# EAGLE design Adafruit MIDI FeatherWing (EAGLE 9.6.2)
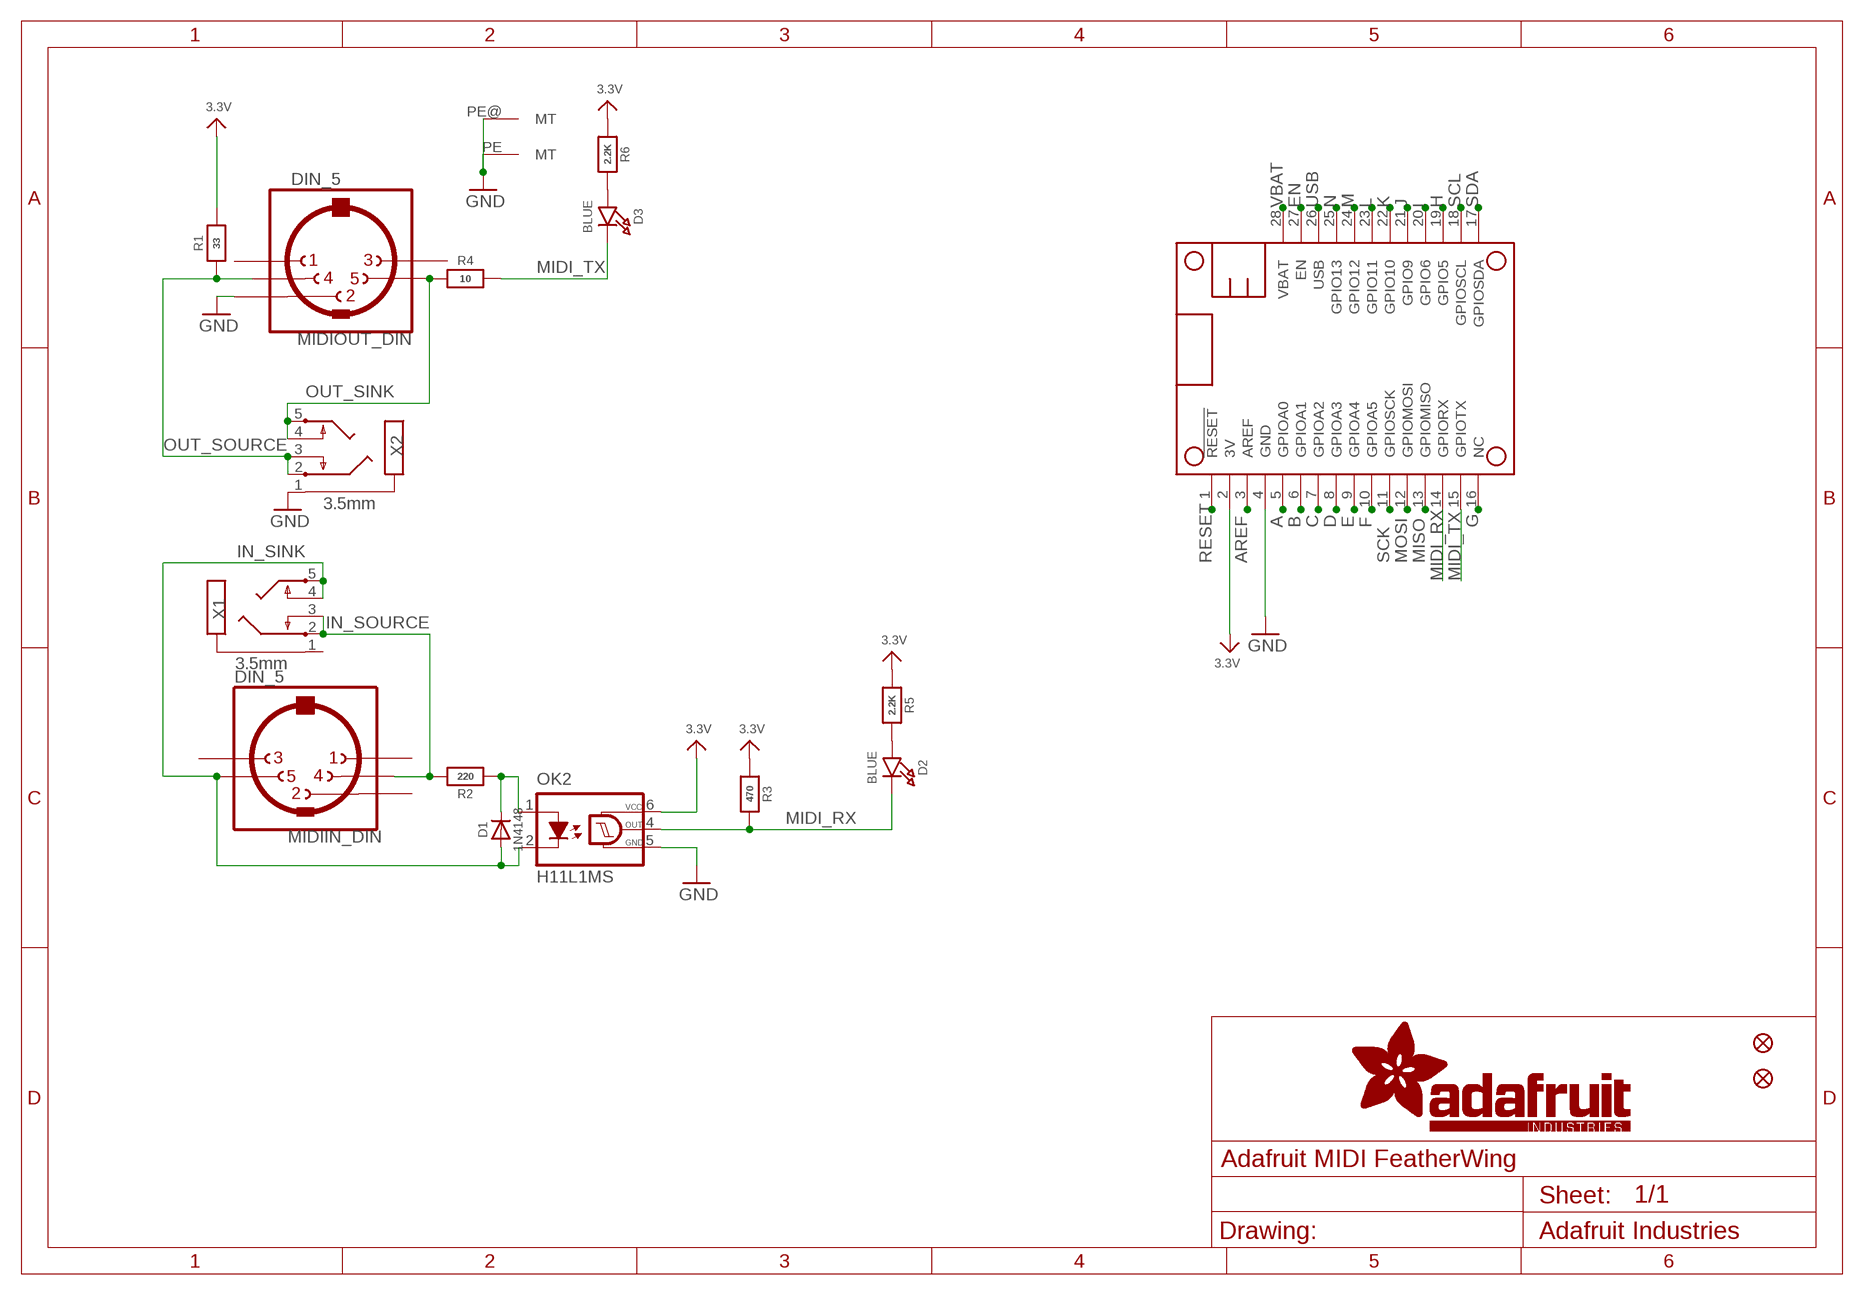
[diagram p0: schematic, sheet 1]

## Parts
D1  1N4148  DIODESOD-323  [SOD-323]
D2  BLUE  LED0603  [CHIPLED_0603]
D3  BLUE  LED0603  [CHIPLED_0603]
FID1  FIDUCIAL_1MM  [FIDUCIAL_1MM]
FID2  FIDUCIAL_1MM  [FIDUCIAL_1MM]
MIDIIN  DIN_5  [CP-2350]
MIDIOUT  DIN_5  [CP-2350]
MS1  FEATHERWING_NODIM  [FEATHERWING_NODIM]
OK2  H11L1MS  [DIL6-SMD]
R1  33  RESISTOR_0603_NOOUT  [0603-NO]
R2  220  RESISTOR_0603_NOOUT  [0603-NO]
R3  470  RESISTOR_0603_NOOUT  [0603-NO]
R4  10  RESISTOR_0603_NOOUT  [0603-NO]
R5  2.2K  RESISTOR_0603_NOOUT  [0603-NO]
R6  2.2K  RESISTOR_0603_NOOUT  [0603-NO]
X1  3.5mm  AUDIO_STEREOJACK  [STX3100]
X2  3.5mm  AUDIO_STEREOJACK  [STX3100]

## Nets
3.3V: MS1.2(3V) OK2.6(VCC) R1.2 R3.1 R5.1 R6.1
A: MS1.5(GPIOA0)
AREF: MS1.3(AREF)
B: MS1.6(GPIOA1)
C: MS1.7(GPIOA2)
D: MS1.8(GPIOA3)
E: MS1.9(GPIOA4)
EN: MS1.27(EN)
F: MS1.10(GPIOA5)
G: MS1.16(NC)
GND: MIDIOUT.2 MIDIOUT.PE(MT) MIDIOUT.PE@(MT) MS1.4(GND) OK2.5(GND) X2.1
H: MS1.19(GPIO5)
I: MS1.20(GPIO6)
IN_SINK: D1.A MIDIIN.5 OK2.2(C) X1.4 X1.5
IN_SOURCE: MIDIIN.4 R2.2 X1.2 X1.3
J: MS1.21(GPIO9)
K: MS1.22(GPIO10)
L: MS1.23(GPIO11)
M: MS1.24(GPIO12)
MIDI_RX: D2.C MS1.14(GPIORX) OK2.4(OUT) R3.2
MIDI_TX: D3.C MS1.15(GPIOTX) R4.2
MISO: MS1.13(GPIOMISO)
MOSI: MS1.12(GPIOMOSI)
N: MS1.25(GPIO13)
N$1: D2.A R5.2
N$2: D3.A R6.2
N$33: D1.C OK2.1(A) R2.1
OUT_SINK: MIDIOUT.5 R4.1 X2.4 X2.5
OUT_SOURCE: MIDIOUT.4 R1.1 X2.2 X2.3
RESET: MS1.1(!RESET)
SCK: MS1.11(GPIOSCK)
SCL: MS1.18(GPIOSCL)
SDA: MS1.17(GPIOSDA)
USB: MS1.26(USB)
VBAT: MS1.28(VBAT)
Unconnected: MIDIIN.1 MIDIIN.2 MIDIIN.3 MIDIIN.PE1(MT) MIDIIN.PE2(MT) MIDIIN.PE(MT) MIDIIN.PE@(MT) MIDIOUT.1 MIDIOUT.3 MIDIOUT.PE1(MT) MIDIOUT.PE2(MT) X1.1

## Library data of the parts
D1 = microbuilder:DIODE: Diode SMA Model Volts Amps Type Vf Ir Digikey # Notes SSA34-E3 40V 3A Schottky 480mV @ 3A 200uA @ 40V SSA34-E3/61TGITR-ND CDBA120-G 20V 1A Schottky 500mV @ 1A 500uA @ 20V 641-1014-6-ND REEL MBRA210 10V 2A Schottky 350mV @ 2A 700uA @ 10V MBRA210LT3 SOD-123 Model Volts Amps Type Vf Ir Order # Notes BAT54T1G 30V 200mA Schottky 800mV @ 200mA 2uA @ 25V BAT54T1GOSTR-ND B0530W 30V 500mA Schottky 430mV @ 500mA 130uA @ 30V B0530W-FDICT-ND REEL MBR120 20V 1A Schottky 340mV @ 1A MBR120VLSFT1GOSCT-ND SOD-323 Model Volts Amps Type Vf Ir Order # Notes PMEG2005EJ 20V 500mA Schottky 355mV @ 500mA 568-4110-1-ND ZLLS410 10V 570mA Schottky 380mV @ 570mA ZLLS410CT-ND 1N4148WS 75V 150mA Silicon/Simple 1V 1N4148WSFSCT-ND REEL SOD-523 Model Volts Amps Type Vf Ir Order # Notes BAT54XV2 30V 200mA Schottky 0.8V @ 100mA BAT54XV2CT-ND TB751S 30V 30mA Schottky RB751S-40TE61CT-ND SOT23-R/W (R = Solder Paste/Reflow Ovens, W = Hand-Soldering) Model Volts Amps Type Vf Ir Order # Notes BAT54FILM 40V 300mA Schottky 497-7162-1-ND POWERDI-5 Model Volts Amps Type Vf Ir Order # Notes PDS560 60V 5A Schottky 670mV @ 5A 150uA @ 60V PDS560DICT-ND
D2 D3 = microbuilder:LED: LED 0603 - 0603 Surface Mount Package 2mA: Green LED - Low Power (3.9mcd, 2ma, 1.7Vf) - Digikey: 475-2709-2-ND Orange LED - Low Power (9.8mcd, 2ma, 1.8Vf) - Digikey: 475-1194-2-ND Red LED - Low Power (5mcd, 2ma, 1.8Vf) - Digikey: 475-1195-2-ND Yellow LED - Low Power (7mcd, 2ma, 1.8Vf) - Digikey: 475-1196-2-ND 5mA: Blue LED - Low Power (17mcd, 5ma, 2.9Vf) - Digikey: LNJ937W8CRACT-ND 0805 - 0805 Surface Mount Package 2mA: Red LED (8.8mcd, 2mA, 1.8Vf, Clear) - Low Power [Digikey: 475-2510-1-ND] Green LED (5mcd, 2mA, 1.8Vf, Clear) - Low Power [Digikey: 475-2730-1-ND] Yellow LED (11.3mcd, 2mA, 1.8Vf, Clear) - Low Power [Digikey: 475-2555-1-ND] 20mA: Red LED (104mcd, 20mA, Diffused) - LS R976 [Digikey: 475-1278-6-ND] Red LED (12mcd, 20mA, 2.0Vf, Clear) - APT2012EC [Digikey: 754-1128-1-ND] Green LED (15mcd, 20mA, 2.2Vf, Clear) - APT2012GC [Digikey: 754-1131-1-ND] Orange LED (160mcd, 20mA, 2.1Vf, Clear) - APT2012SECK [Digikey: 754-1130-1-ND] 1206 - 1206 Surface Mount Package Green LED (26mcd, 20mA, Diffused) - LG N971 [Digikey: 475-1407-6-ND] Red LED (15mcd, 20mA, Diffused) - LH N974 [Digikey: 475-1416-6-ND] Cree - Cree High-Power Surface Mount LEDs XPEBWT-L1-0000-00D50 - White 111lm 350mA 2.9Vf 6200K 110° XTEAWT-00-0000-00000LEE3 - White 114lm 350mA 2.85Vf 5000K 115° Everlight - Everlight 45-21 Series Surface Mount LEDs 45-21/QK2C-B2832AC2CB2/2T - Warm White 2000mcd 20mA 3.25Vf 3050K 120° 45-21/LK2C-B38452C4CB2/2T - Nuetral White 2000mcd 20mA 3.25Vf 4150K 120° 45-21/LK2C-B50634C6CB2/2T - Cold White 2200mcd 20mA 3.25Vf 5650K 120° PLCC2 Reverse Mount LS T77K-J1L2-1-0-2-R18-Z - Red 11.25mcd 2mA 1.8Vf 630nm 120° LO T77K-L1M2-24-Z - Orange 19.6mcd 2mA 1.8Vf 606nm 120° LY T77K-K2M1-26-Z - Yellow 15.7mcd 2mA 1.8Vf 587nm 120°
FID1 FID2 = microbuilder:FIDUCIAL: Fiducial Alignment Points Various fiducial points for machine vision alignment.; BOM: EXCLUDE
MIDIIN MIDIOUT = microbuilder:DIN_5
MS1 = microbuilder:FEATHERWING
OK2 = optocoupler:H11L*M: 6-Pin DIP Optocoupler Source: http://www.fairchildsemi.com/ds/H1/H11L2-M.pdf; OC_FARNELL: unknown; OC_NEWARK: unknown
R1-R6 = microbuilder:RESISTOR: Resistors For new designs, use the packages preceded by an '_' character since they are more reliable: The following footprints should be used on most boards: _0402 - Standard footprint for regular board layouts _0603 - Standard footprint for regular board layouts _0805 - Standard footprint for regular board layouts _1206 - Standard footprint for regular board layouts For extremely tight-pitch boards where space is at a premium, the following 'micro-pitch' footprints can be used (smaller pads, no silkscreen outline, etc.): _0402MP - Micro-pitch footprint for very dense/compact boards _0603MP - Micro-pitch footprint for very dense/compact boards _0805MP - Micro-pitch footprint for very dense/compact boards _1206MP - Micro-pitch footprint for very dense/compact boards
X1 X2 = microbuilder:AUDIO_STEREOJACK: MIC/HEADPHONE JACK Stereo jack with two switches. Kycon STX3100, CUI SJ1-3555NG and/or 4UCon 05544 Digikey: CP1-3555NG-ND Shamelessly taken from the Adafruit Eagle library (public domain) ... thanks! These are normally connected as follows, from right-to-left on the schematic symbol above: Tip: Left Audio Inner Ring: Right Audio Shell: Common/GND

## Net classes
1 VCC: width 0.305 mm
2 GND: width 0.813 mm
3 HV: width 0.381 mm

## Board
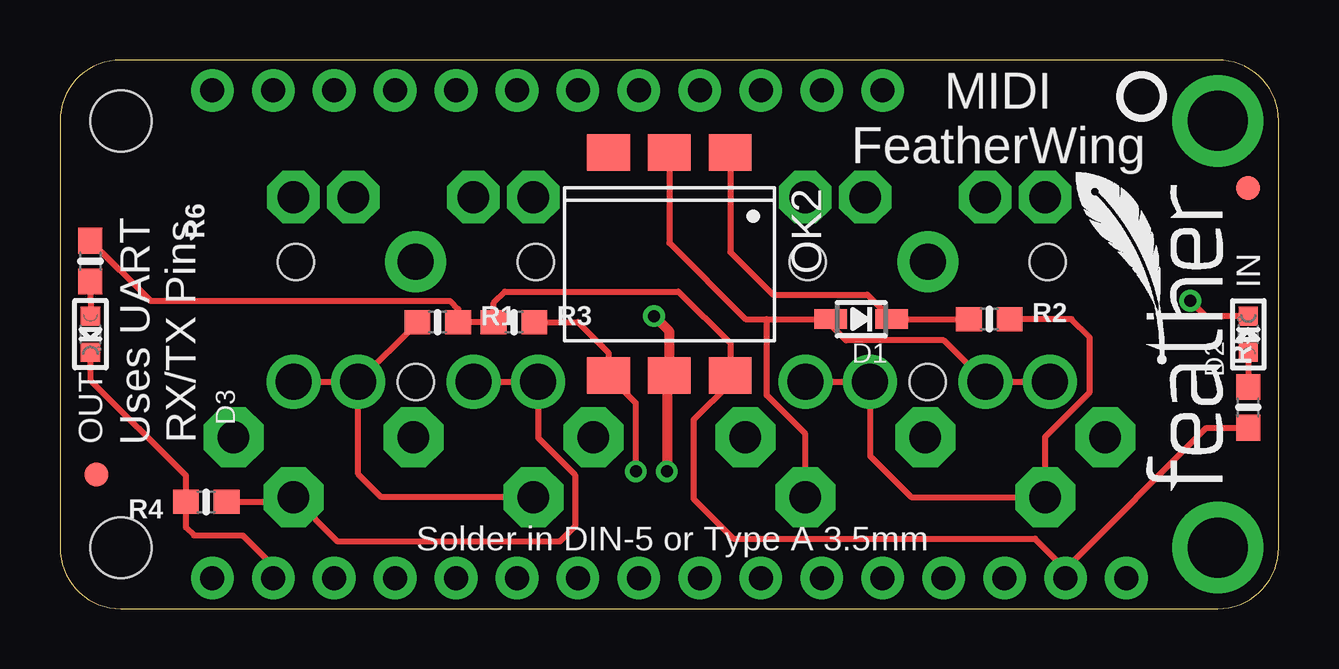
[diagram p1: board, top side]
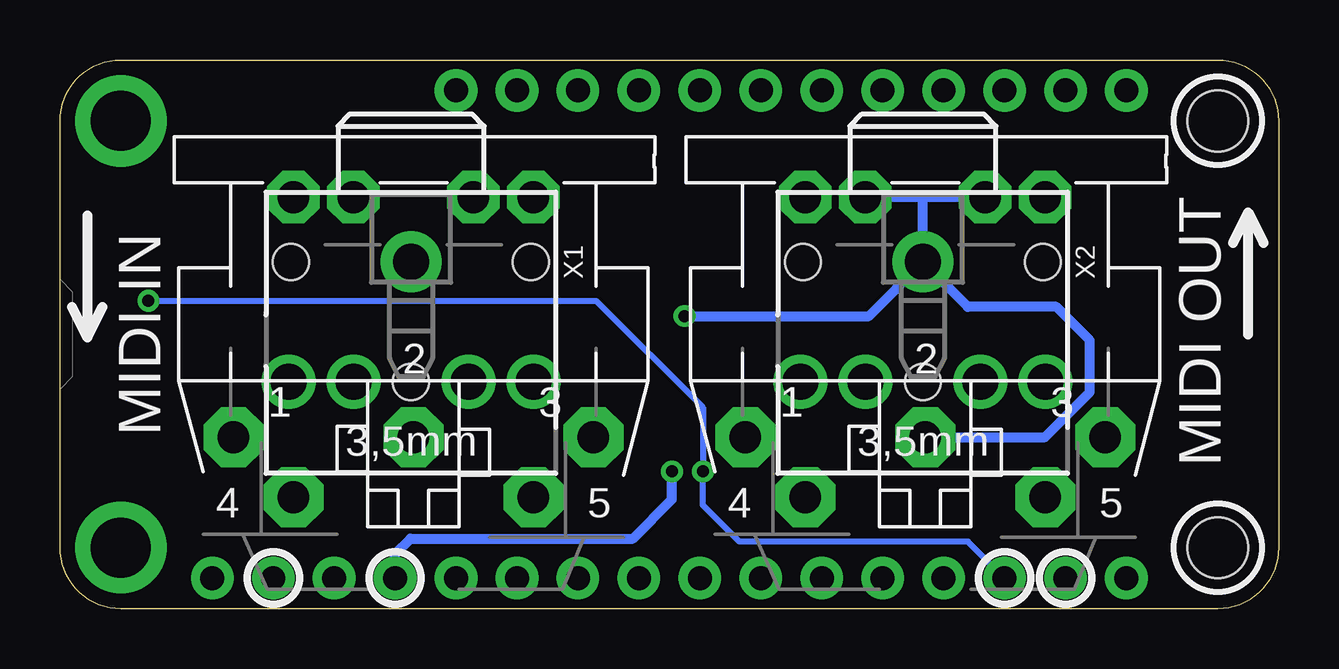
[diagram p2: board, bottom side, seen from below]

Size 50.8 x 22.86 mm. Coordinates in mm from the lower left corner, seen from the top.
Outline: 0,20.32 0,2.54 arc90 2.54,0 48.26,0 arc90 50.8,2.54 50.8,20.32 arc90 48.26,22.86 2.54,22.86 arc90 0,20.32
Copper layers (1*16): Top 0.035mm / dielectric 1.5mm / Bottom 0.035mm
Design rules "adafruit": minimum track width 8mil, minimum drill 15.5mil, track to track 8mil, track to pad 8mil, pad to pad 8mil, via to via 8mil, smd to smd 8mil, copper to edge 10mil, drill to drill 8mil, minimum pad ring 10mil, minimum via ring 8mil, stop-mask expansion 2mil, vias tented up to drill 20mil, thermal gap 10mil

### Footprints (pad centres in the part's own frame; a part is rotated, then mirrored left to right if it is on the bottom)
SOD-323 = smd 1.35 x 0.8: A 1.27,0; C -1.27,0
CHIPLED_0603 = smd 0.8 x 0.8: A 0,-0.75; C 0,0.75
FIDUCIAL_1MM = smd 1 x 1: 1 0,0
CP-2350 = drill 1.321 pad 2.5 octagon: 1 7.5,10; 2 0,10; 3 -7.5,10; 4 5,12.5; 5 -5,12.5 | drill 1.321 pad 2.184 octagon: PE -2.5,0; PE1 -5,0; PE2 5,0; PE@ 2.5,0
FEATHERWING_NODIM = drill 1 pad 1.778: 1 6.35,1.27; 2 8.89,1.27; 3 11.43,1.27; 4 13.97,1.27; 5 16.51,1.27; 6 19.05,1.27; 7 21.59,1.27; 8 24.13,1.27; 9 26.67,1.27; 10 29.21,1.27; 11 31.75,1.27; 12 34.29,1.27; 13 36.83,1.27; 14 39.37,1.27; 15 41.91,1.27; 16 44.45,1.27; 17 44.45,21.59; 18 41.91,21.59; 19 39.37,21.59; 20 36.83,21.59; 21 34.29,21.59; 22 31.75,21.59; 23 29.21,21.59; 24 26.67,21.59; 25 24.13,21.59; 26 21.59,21.59; 27 19.05,21.59; 28 16.51,21.59 | drill 2.5 pad 3.81: P$1 2.54,20.32; P$2 2.54,2.54 | hole 2.54: 48.26,20.32; 48.26,2.54
DIL6-SMD = smd 1.78 x 1.52: 1 -2.54,-4.645; 2 0,-4.645; 3 2.54,-4.645; 4 2.54,4.645; 5 0,4.645; 6 -2.54,4.645
0603-NO = smd 1.075 x 1: 1 -0.85,0; 2 0.85,0
STX3100 = drill 1.5 pad 2.54: 1 2.7,-0.1 | drill 1.5: 2 7.7,5; 3 7.7,2.3; 4 7.7,-2.5; 5 7.7,-5.2 | hole 1.5: 2.7,4.9; 2.7,-5.1; 7.7,-0.1

### Placement (x,y rotation side)
D1  33.4,12.06 180 top
D2  49.53,11.43 0 top
D3  1.27,11.43 180 top
FID1  1.52,5.59 0 top
FID2  49.53,17.53 0 top
MIDIIN  36.07,17.14 180 bottom
MIDIOUT  14.73,17.14 180 bottom
MS1  50.8,0 0 bottom
OK2  25.4,14.35 180 top
R1  15.75,11.94 0 top
R2  38.73,12.06 0 top
R3  18.92,11.94 0 top
R4  6.1,4.45 180 top
R5  49.53,8.38 90 top
R6  1.27,14.48 270 top
U$8  [PCBFEAT-REV-040]  45.09,21.34 0 top
U$9  [FEATHERLOGO_SMALL]  48.51,4.83 90 top
X1  36.07,17.14 270 bottom
X2  14.73,17.14 270 bottom

### Tracks (layer width: path | path; a pad name or v marks a point on that pad's centre or on a via)
3.3V
  Top 0.254: R6.1 3.77,12.83 16.26,12.83 16.6,12.48 R1.2 R3.1 18.07,12.74 18.54,13.21 25.78,13.21 27.94,11.05 OK2.6 27.94,9.4 26.42,7.87 26.42,4.57 28.07,2.92 40.64,2.92 41.91,1.65 | MS1.2 41.91,1.65 | R5.1 47.79,7.53 41.91,1.65
GND  (via drill 0.5)
  Top 0.406: v24.77,12.19 25.4,11.56 OK2.5 25.29,9.6 v25.29,5.71
  Bottom 0.254: 14.83,17.12 14.86,17.14
  Bottom 0.406: MIDIOUT.PE 14.86,17.14 MIDIOUT.PE@ | X2.1 14.83,17.12 | MIDIOUT.2 9.75,7.14 7.87,9.02 7.87,11.18 9.27,12.57 12.96,12.57 X2.1 | v24.77,12.19 17.09,12.19 X2.1 | MS1.4 36.83,2.29 36.2,2.92 26.92,2.92 25.29,4.55 v25.29,5.71
IN_SINK
  Top 0.254: OK2.2 25.4,15.24 28.57,12.06 29.46,12.06 | 29.46,12.06 D1.A 32.13,11.81 32.77,11.18 36.84,11.18 X1.4 X1.5 | MIDIIN.5 31.07,7.29 29.46,8.89 29.46,12.06
IN_SOURCE
  Top 0.254: X1.2 X1.3 33.77,6.36 35.49,4.64 MIDIIN.4 41.07,7.16 42.93,9.02 42.93,11.3 42.16,12.06 R2.2
MIDI_RX  (via drill 0.5)
  Top 0.254: R3.2 21.59,11.94 22.86,10.67 OK2.4 24,8.56 v24,5.71 | D2.C 47.76,12.18 v47.12,12.83
  Bottom 0.254: MS1.14 12.95,2.79 22.48,2.79 24,4.32 v24,5.71 24,8.38 28.45,12.83 v47.12,12.83
MIDI_TX
  Top 0.254: D3.C 1.27,9.53 5.25,5.55 R4.2 5.25,3.39 5.59,3.05 7.62,3.05 8.89,1.78 MS1.15
N$1
  Top 0.254: D2.A R5.2
N$2
  Top 0.254: D3.A 1.32,12.23 R6.2
N$33
  Top 0.254: OK2.1 27.94,14.86 29.72,13.08 33.66,13.08 D1.C R2.1
OUT_SINK
  Top 0.254: R4.1 9.53,4.45 MIDIOUT.5 11.58,2.79 20.83,2.79 21.46,3.43 21.46,5.59 19.93,7.12 X2.5 X2.4
OUT_SOURCE
  Top 0.254: X2.2 X2.3 | X2.3 14.9,11.91 R1.1 | MIDIOUT.4 13.39,4.64 12.43,5.6 X2.3

### Text on the board
tPlace: MIDI / FeatherWing | IN | Uses UART / RX/TX Pins | OUT | Solder in DIN-5 or Type A 3.5mm
bPlace: MIDI OUT | MIDI IN